# EAGLE design Robot (EAGLE 9.6.1)

## Sheet 1 of 2
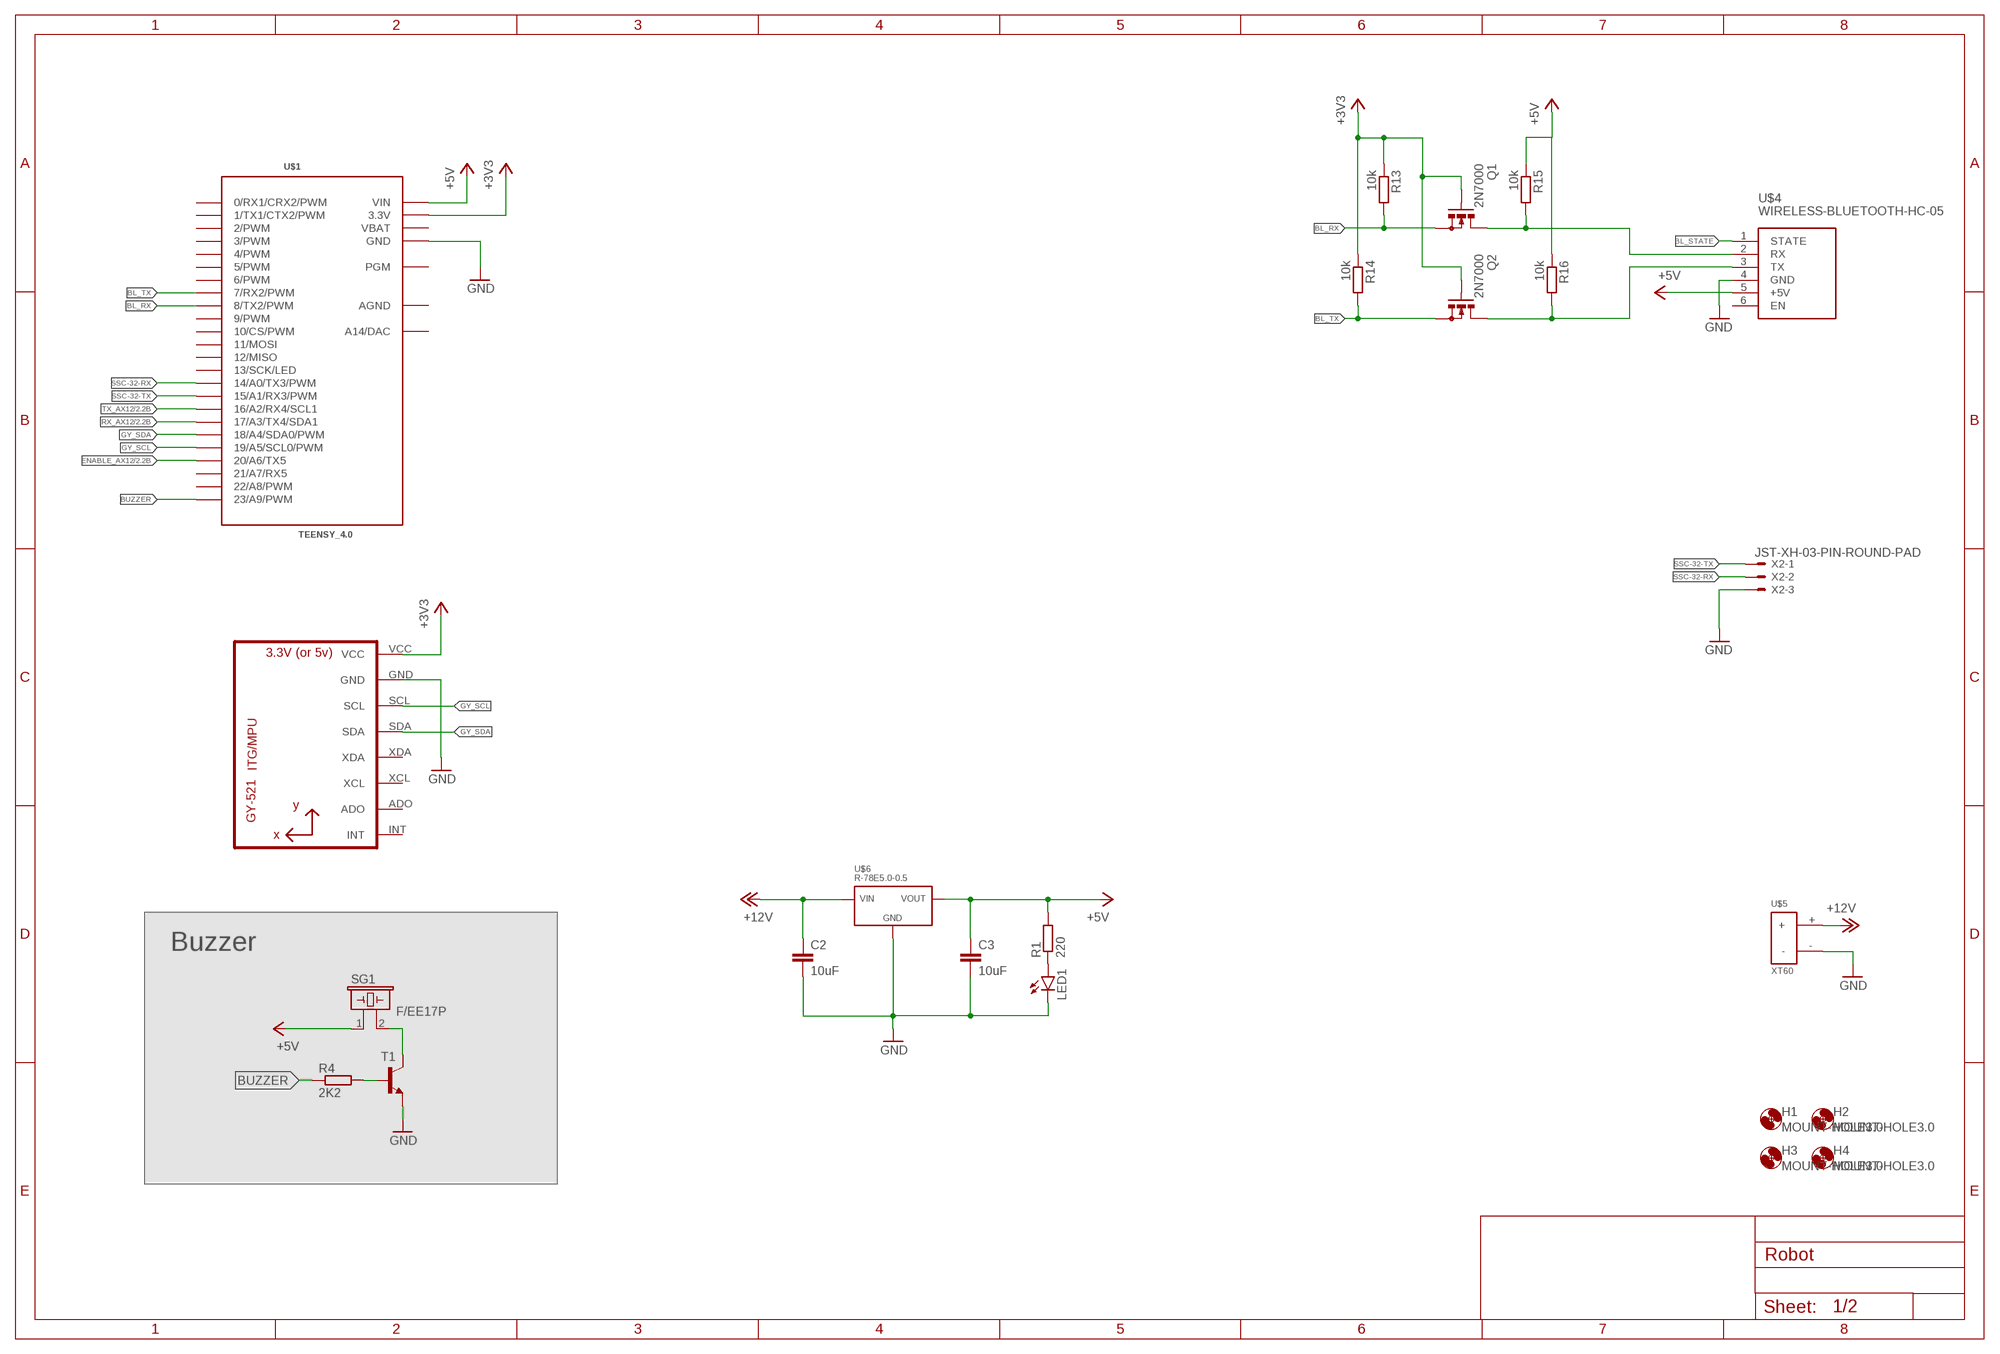
[diagram p0: schematic, sheet 1]

### Parts
C2  10uF  C-EU050-024X044  [C050-024X044]
C3  10uF  C-EU050-024X044  [C050-024X044]
H1  MOUNT-HOLE3.0  [3,0]
H2  MOUNT-HOLE3.0  [3,0]
H3  MOUNT-HOLE3.0  [3,0]
H4  MOUNT-HOLE3.0  [3,0]
LED1  LED5MM  [LED5MM]
Q1  2N7000  BS170  [SOT54E]
Q2  2N7000  BS170  [SOT54E]
R1  220  R-EU_0207/10  [0207/10]
R4  2K2  R-EU_0207/10  [0207/10]
R13  10k  R-EU_0207/10  [0207/10]
R14  10k  R-EU_0207/10  [0207/10]
R15  10k  R-EU_0207/10  [0207/10]
R16  10k  R-EU_0207/10  [0207/10]
SG1  F/EE17P  [F/EE17P]
T1  -NPN-TO92-EBC  [TO92-EBC]
U1  GY-521MPU6050  [GY-521]
U$1  TEENSY_4.0  [TEENSY_4.0]
U$4  WIRELESS-BLUETOOTH-HC-05  [WIRELESS-BLUETOOTH-HC-05]
U$5  XT60  [XT60]
U$6  R-78E5.0-0.5  [R-78E5.0-0.5]
X2  JST-XH-03-PIN-ROUND-PAD  [JST-XH-03-PACKAGE-ROUND-PAD]

### Nets
+3V3: U1.VCC U$1.3V3(3.3V) U$1.3V3_1(3.3V)
+5V: C3.1 R1.2 SG1.1 U$1.VIN U$4.5(+5V) U$6.VOUT ; also sheet 2
+12V: C2.1 U$5.+ U$6.VIN ; also sheet 2
BL_RX: Q1.S R13.2 U$1.8(8/TX2/PWM)
BL_STATE: U$4.1(STATE)
BL_TX: Q2.S R14.2 U$1.7(7/RX2/PWM)
BUZZER: R4.1 U$1.23(23/A9/PWM)
ENABLE_AX12: U$1.20(20/A6/TX5) ; also sheet 2
GND: C2.2 C3.2 LED1.K(C) T1.E U1.GND U$1.GND U$1.GND2(GND) U$4.4(GND) U$5.- U$6.GND X2.3 ; also sheet 2
GY_SCL: U1.SCL U$1.19(19/A5/SCL0/PWM)
GY_SDA: U1.SDA U$1.18(18/A4/SDA0/PWM)
N$1: Q1.G Q2.G R13.1 R14.1 ; supply symbol labelled +3V3
N$3: R15.1 R16.1 ; supply symbol labelled +5V
N$5: LED1.A R1.1
N$7: R4.2 T1.B
N$8: SG1.2 T1.C
N$100: Q1.D R15.2 U$4.2(RX)
N$1001: Q2.D R16.2 U$4.3(TX)
RX_AX12: U$1.17(17/A3/TX4/SDA1) ; also sheet 2
SSC-32-RX: U$1.14(14/A0/TX3/PWM) X2.2
SSC-32-TX: U$1.15(15/A1/RX3/PWM) X2.1
TX_AX12: U$1.16(16/A2/RX4/SCL1) ; also sheet 2
Unconnected: U1.ADO U1.INT U1.XCL U1.XDA U$1.0(0/RX1/CRX2/PWM) U$1.1(1/TX1/CTX2/PWM) U$1.2(2/PWM) U$1.3(3/PWM) U$1.4(4/PWM) U$1.5(5/PWM) U$1.6(6/PWM) U$1.9(9/PWM) U$1.10(10/CS/PWM) U$1.11(11/MOSI) U$1.12(12/MISO) U$1.13(13/SCK/LED) U$1.21(21/A7/RX5) U$1.22(22/A8/PWM) U$1.PGM U$1.RESET/DAC(A14/DAC) U$4.6(EN)

### Notes on the sheet
- Buzzer

## Sheet 2 of 2
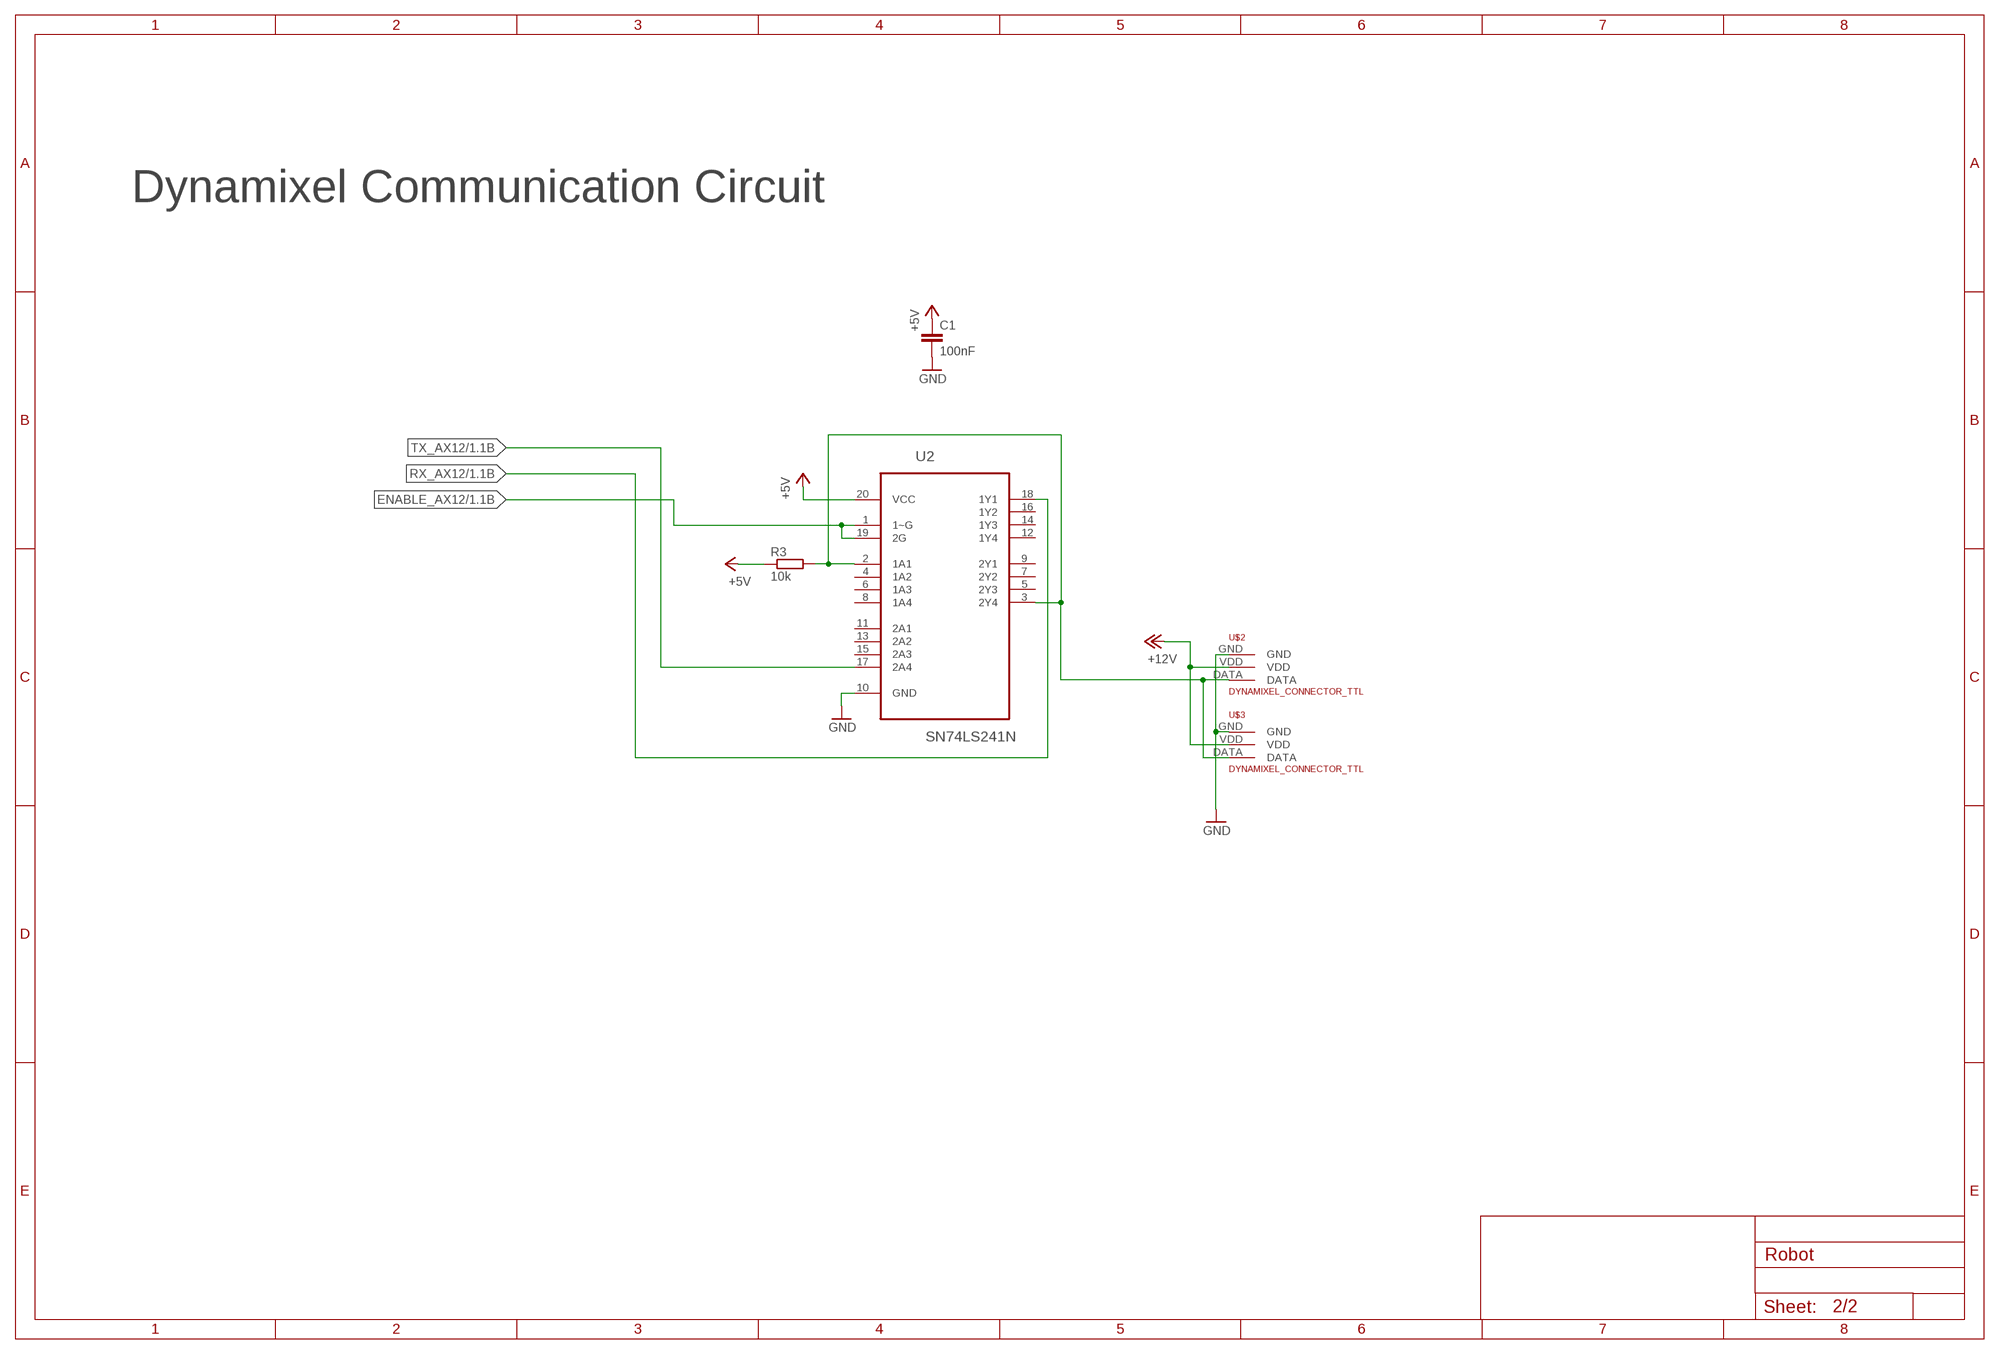
[diagram p1: schematic, sheet 2]

### Parts
C1  100nF  C-EU050-024X044  [C050-024X044]
R3  10k  R-EU_0207/10  [0207/10]
U2  SN74LS241N  [DIP254P762X508-20]
U$2  DYNAMIXEL_CONNECTOR_TTL  [DYNAMIXEL_CONNECTOR_TTL]
U$3  DYNAMIXEL_CONNECTOR_TTL  [DYNAMIXEL_CONNECTOR_TTL]

### Nets
+5V: C1.1 R3.1 U2.20(VCC) ; also sheet 1
+12V: U$2.VDD U$3.VDD ; also sheet 1
DATA: R3.2 U2.2(1A1) U2.3(2Y4) U$2.DATA U$3.DATA
ENABLE_AX12: U2.1(1~G) U2.19(2G) ; also sheet 1
GND: C1.2 U2.10(GND) U$2.GND U$3.GND ; also sheet 1
RX_AX12: U2.18(1Y1) ; also sheet 1
TX_AX12: U2.17(2A4) ; also sheet 1
Unconnected: U2.4(1A2) U2.5(2Y3) U2.6(1A3) U2.7(2Y2) U2.8(1A4) U2.9(2Y1) U2.11(2A1) U2.12(1Y4) U2.13(2A2) U2.14(1Y3) U2.15(2A3) U2.16(1Y2)

### Notes on the sheet
- Dynamixel Communication Circuit

## Power pins joined to a net without a drawn wire
AGND: U$1.AGND
VBAT: U$1.VBAT

## Library data of the parts
C1-C3 = rcl:C-EU: CAPACITOR, European symbol; SPICEPREFIX: C
H1-H4 = holes:MOUNT-HOLE: MOUNTING HOLE with drill center marker
LED1 = led:LED: LED OSRAM: - CHIPLED LG R971, LG N971, LY N971, LG Q971, LY Q971, LO R971, LY R971 LH N974, LH R974 LS Q976, LO Q976, LY Q976 LO Q996 - Hyper CHIPLED LW Q18S LB Q993, LB Q99A, LB R99A - SideLED LS A670, LO A670, LY A670, LG A670, LP A670 LB A673, LV A673, LT A673, LW A673 LH A674 LY A675 LS A676, LA A676, LO A676, LY A676, LW A676 LS A679, LY A679, LG A679 - Hyper Micro SIDELED® LS Y876, LA Y876, LO Y876, LY Y876 LT Y87S - SmartLED LW L88C, LW L88S LB L89C, LB L89S, LG L890 LS L89K, LO L89K, LY L89K LS L896, LA L896, LO L896, LY L896 - TOPLED LS T670, LO T670, LY T670, LG T670, LP T670 LSG T670, LSP T670, LSY T670, LOP T670, LYG T670 LG T671, LOG T671, LSG T671 LB T673, LV T673, LT T673, LW T673 LH T674 LS T676, LA T676, LO T676, LY T676, LB T676, LH T676, LSB T676, LW T676 LB T67C, LV T67C, LT T67C, LS T67K, LO T67K, LY T67K, LW E67C LS E67B, LA E67B, LO E67B, LY E67B, LB E67C, LV E67C, LT E67C LW T67C LS T679, LY T679, LG T679 LS T770, LO T770, LY T770, LG T770, LP T770 LB T773, LV T773, LT T773, LW T773 LH T774 LS E675, LA E675, LY E675, LS T675 LS T776, LA T776, LO T776, LY T776, LB T776 LHGB T686 LT T68C, LB T68C - Hyper Mini TOPLED® LB M676 - Mini TOPLED Santana® LG M470 LS M47K, LO M47K, LY M47K Source: http://www.osram.convergy.de LUXEON: - LUMILED® LXK2-PW12-R00, LXK2-PW12-S00, LXK2-PW14-U00, LXK2-PW14-V00 LXK2-PM12-R00, LXK2-PM12-S00, LXK2-PM14-U00 LXK2-PE12-Q00, LXK2-PE12-R00, LXK2-PE12-S00, LXK2-PE14-T00, LXK2-PE14-U00 LXK2-PB12-K00, LXK2-PB12-L00, LXK2-PB12-M00, LXK2-PB14-N00, LXK2-PB14-P00, LXK2-PB14-Q00 LXK2-PR12-L00, LXK2-PR12-M00, LXK2-PR14-Q00, LXK2-PR14-R00 LXK2-PD12-Q00, LXK2-PD12-R00, LXK2-PD12-S00 LXK2-PH12-R00, LXK2-PH12-S00 LXK2-PL12-P00, LXK2-PL12-Q00, LXK2-PL12-R00 Source: www.luxeon.com KINGBRIGHT: KA-3528ASYC Source: www.kingbright.com
Q1 Q2 = transistor-small-signal:BS170: N-CHANNEL MOS FET
R1 R3 R4 R13-R16 = rcl:R-EU_: RESISTOR, European symbol; SPICEPREFIX: R
SG1 = buzzer:F/EE17P: BUZZER Source: Buerklin; OC_FARNELL: unknown; OC_NEWARK: unknown
T1 = transistor:*-NPN-: NPN Transistror BF959 corrected 2008.03.06
U1 = gy-521:GY-521
U2 = SN74LS241N:SN74LS241N: OCTAL BUFFERS AND LINE DRIVERS WITH 3-STATE OUTPUTS; AVAILABILITY: Unavailable; MF: Texas Instruments; MP: SN74LS241N; PACKAGE: PDIP-20 Motorola; PRICE: None
U$1 = Teensy_3_and_LC_Series_Boards_v1.4:TEENSY_4.0
U$2 U$3 = DYNAMIXEL_CONNECTOR_TTL:DYNAMIXEL_CONNECTOR_TTL
U$4 = TP4056:WIRELESS-BLUETOOTH-HC-05: Bluetooth Transceiver Module based on HC-05 board Tutorial is available here: https://arduino-info.wikispaces.com/BlueTooth-HC05-HC06-Modules-How-To Click here to find device on ebay.com <http://www.ebay.com/sch/hc-05+module+rs232>
U$5 = XT60:XT60
U$6 = Power:R-78E5.0-0.5
X2 = JST XH Connectors v1-0:JST-XH-03-PIN: JST XH Connector 2 Pin Wire to board connector. Pitch: 2,54 mm, (0.100") Number of pins: 3 Created by Rembrandt Electronics www.rembrandtelectronics.com

## Board
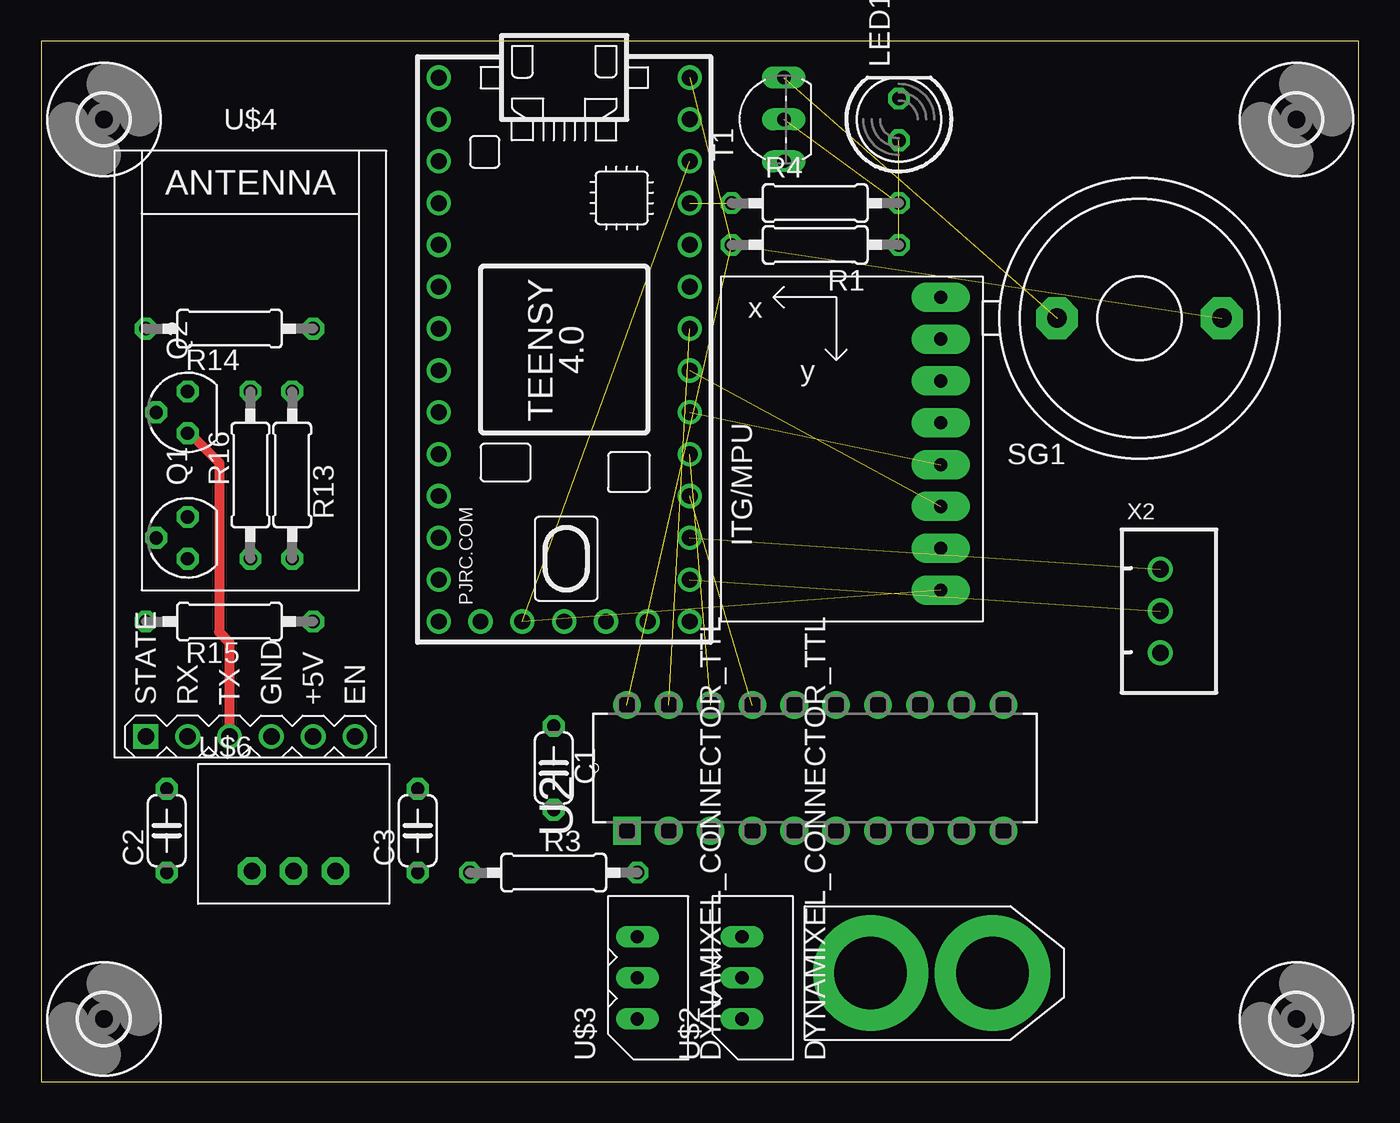
[diagram p2: board, top side]
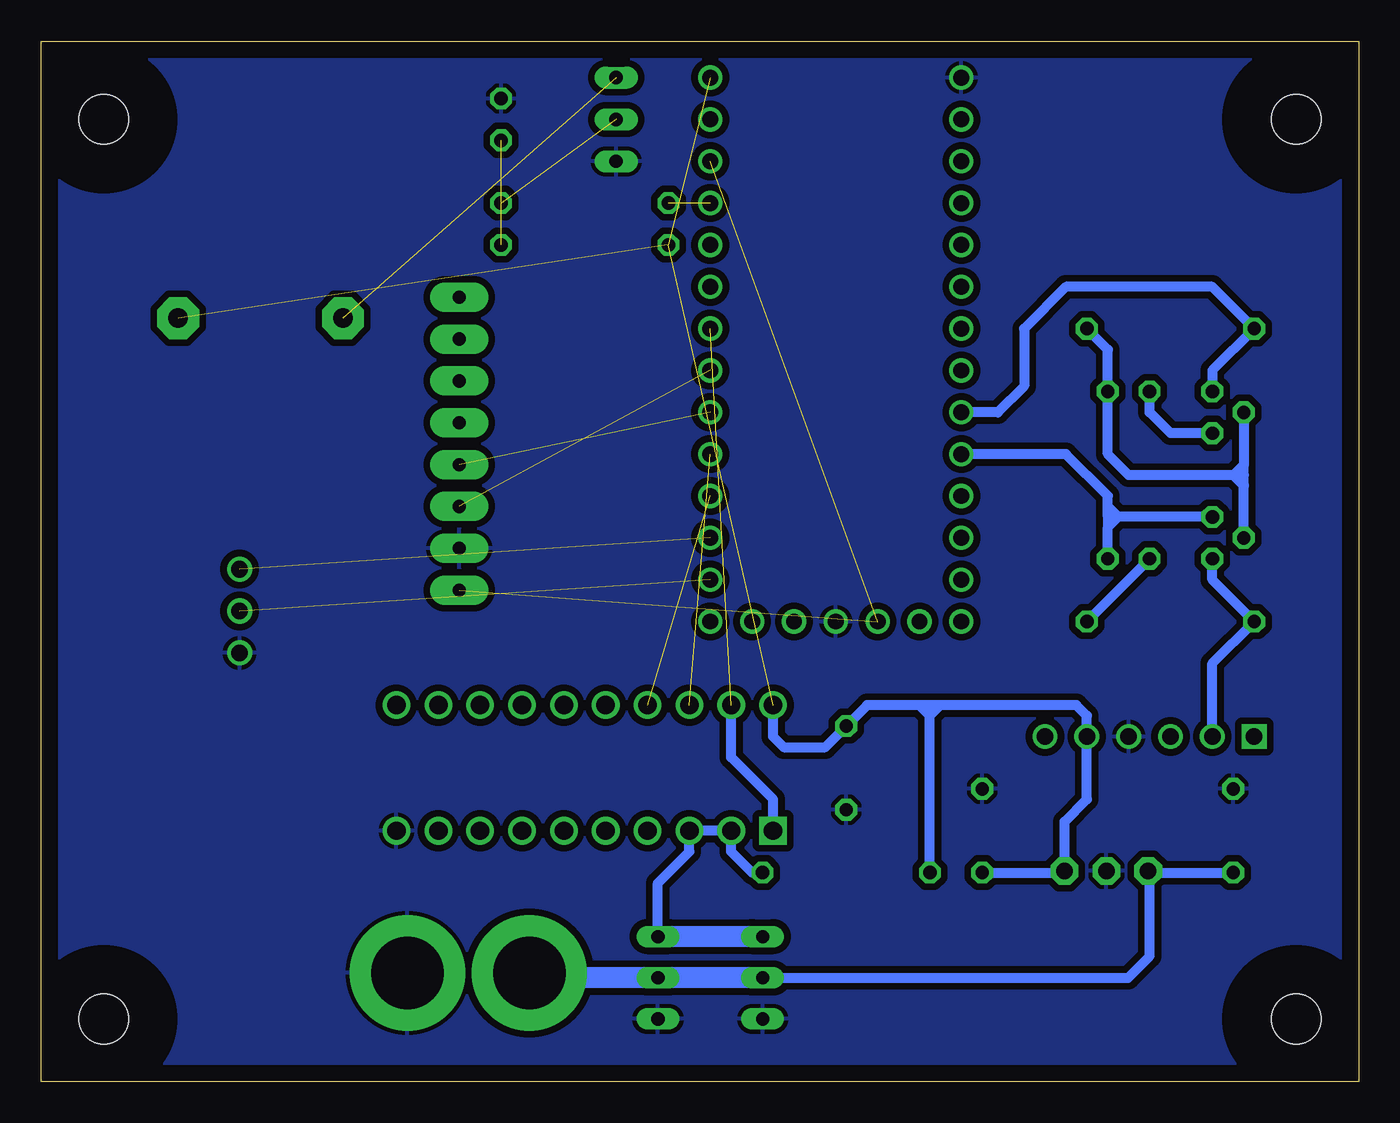
[diagram p3: board, bottom side, seen from below]

Size 79.99 x 63.17 mm. Coordinates in mm from the lower left corner, seen from the top.
Outline: 0,0 79.99,0 79.99,63.17 0,63.17 0,0
Copper layers (1*16): Top 0.035mm / dielectric 1.5mm / Bottom 0.035mm
Design rules "default": minimum track width 6mil, minimum drill 0.35mm, track to track 6mil, track to pad 6mil, pad to pad 6mil, via to via 6mil, smd to smd 6mil, copper to edge 40mil, drill to drill 6mil, minimum pad ring 10mil, minimum via ring 8mil, stop-mask expansion 4mil, vias tented up to drill 0mil, thermal gap 10mil

### Footprints (pad centres in the part's own frame; a part is rotated, then mirrored left to right if it is on the bottom)
C050-024X044 = drill 0.813 octagon: 1 -2.54,0; 2 2.54,0
3,0 = hole 3: 0,0
LED5MM = drill 0.813 octagon: A -1.27,0; K 1.27,0
SOT54E = drill 0.813 octagon: D -1.27,0; G 0,1.905; S 1.27,0
0207/10 = drill 0.813 octagon: 1 -5.08,0; 2 5.08,0
F/EE17P = drill 1.194 pad 2.54 octagon: 1 -5.004,0; 2 5.004,0
TO92-EBC = drill 0.813 long: B 0,-1.27; C 2.54,-1.27; E -2.54,-1.27
GY-521 = drill 0.8 pad 1.778 long: ADO -8.89,-6.35; GND -8.89,6.35; INT -8.89,-8.89; SCL -8.89,3.81; SDA -8.89,1.27; VCC -8.89,8.89; XCL -8.89,-3.81; XDA -8.89,-1.27
DIP254P762X508-20 = drill 1.118 square: 1 -7.62,22.86 | drill 1.118: 2 -7.62,20.32; 3 -7.62,17.78; 4 -7.62,15.24; 5 -7.62,12.7; 6 -7.62,10.16; 7 -7.62,7.62; 8 -7.62,5.08; 9 -7.62,2.54; 10 -7.62,0; 11 0,0; 12 0,2.54; 13 0,5.08; 14 0,7.62; 15 0,10.16; 16 0,12.7; 17 0,15.24; 18 0,17.78; 19 0,20.32; 20 0,22.86
TEENSY_4.0 = drill 0.965: 0 -13.97,-7.62; 1 -11.43,-7.62; 2 -8.89,-7.62; 3 -6.35,-7.62; 3V3 -11.43,7.62; 3V3_1 16.51,-2.54; 4 -3.81,-7.62; 5 -1.27,-7.62; 6 1.27,-7.62; 7 3.81,-7.62; 8 6.35,-7.62; 9 8.89,-7.62; 10 11.43,-7.62; 11 13.97,-7.62; 12 16.51,-7.62; 13 16.51,7.62; 14 13.97,7.62; 15 11.43,7.62; 16 8.89,7.62; 17 6.35,7.62; 18 3.81,7.62; 19 1.27,7.62; 20 -1.27,7.62; 21 -3.81,7.62; 22 -6.35,7.62; 23 -8.89,7.62; AGND -13.97,7.62; GND -16.51,-7.62; GND2 16.51,0; PGM 16.51,2.54; RESET/DAC 16.51,5.08; VBAT 16.51,-5.08; VIN -16.51,7.62
DYNAMIXEL_CONNECTOR_TTL = drill 0.8 long: DATA 5,0; GND 0,0; VDD 2.5,0
WIRELESS-BLUETOOTH-HC-05 = drill 1 square: 1 -6.35,-17.145 | drill 1: 2 -3.81,-17.145; 3 -1.27,-17.145; 4 1.27,-17.145; 5 3.81,-17.145; 6 6.35,-17.145
XT60 = drill 4.4 pad 7: + 4,4.064; - 11.4,4.064
R-78E5.0-0.5 = drill 1 pad 1.676 octagon: GND 5.8,2; VIN 3.26,2; VOUT 8.34,2
JST-XH-03-PACKAGE-ROUND-PAD = drill 1.016: 1 -2.54,0; 2 0,0; 3 2.54,0

### Placement (x,y rotation side)
C1  31.11,19.05 270 top
C2  7.62,15.24 90 top
C3  22.86,15.24 90 top
H1  3.81,3.81 0 top
H2  76.2,3.81 0 top
H3  3.81,58.42 0 top
H4  76.2,58.42 0 top
LED1  52.07,58.42 90 top
Q1  8.89,33.02 90 top
Q2  8.89,40.64 90 top
R1  46.99,50.8 180 top
R3  31.11,12.7 0 top
R4  46.99,53.34 0 top
R13  15.24,36.83 270 top
R14  11.43,45.72 180 top
R15  11.43,27.94 180 top
R16  12.7,36.83 90 top
SG1  66.67,46.35 180 top
T1  43.81,58.42 90 top
U1  45.72,38.73 180 top
U2  58.42,22.86 90 top
U$1  31.75,44.45 270 top
U$2  42.55,3.81 90 top
U$3  36.2,3.81 90 top
U$4  12.7,38.1 0 top
U$5  46.35,2.54 0 top
U$6  9.53,10.79 0 top
X2  67.94,28.57 270 top

### Tracks (layer width: path | path; a pad name or v marks a point on that pad's centre or on a via)
+3V3  (2 unrouted)
+5V  (3 unrouted)
  Bottom 0.61: U2.20 35.56,20.95 34.92,20.32 32.38,20.32 C1.1 29.84,22.86 26.67,22.86 | C3.1 17.96,12.7 U$6.VOUT 17.86,15.79 16.51,17.14 U$4.5 16.51,22.23 17.14,22.86 25.4,22.86 | 25.4,22.86 26.04,22.86 | 26.04,22.86 26.67,22.86 | R3.1 26.04,22.23 | 26.04,22.23 26.04,22.86 | 26.67,22.86 26.04,22.23 | 26.04,22.23 25.4,22.86
+12V
  Bottom 0.61: C2.1 12.69,12.7 U$6.VIN 12.7,12.71 12.7,7.62 14.01,6.31 U$3.VDD
  Bottom 1.27: U$3.VDD U$2.VDD 50.06,6.31 U$5.+
BL_RX
  Bottom 0.61: R13.2 15.24,33.66 | 15.24,34.29 15.24,33.66 | 15.24,34.29 15.24,34.92 | 15.24,34.92 15.24,35.56 17.78,38.1 U$1.8 | Q1.S 14.61,34.29 | 14.61,34.29 15.24,34.29 | 15.24,33.66 14.61,34.29 | 14.61,34.29 15.24,34.92
BL_TX
  Bottom 0.61: Q2.S 8.89,43.18 R14.2 8.89,48.26 17.78,48.26 20.32,45.72 20.32,42.23 21.91,40.64 U$1.7
BUZZER  (1 unrouted)
DATA
  Bottom 0.61: R3.2 36.83,12.7 38.1,13.97 U2.2 U2.3 40.64,13.97 42.55,12.06 U$2.DATA
  Bottom 1.27: U$3.DATA U$2.DATA
ENABLE_AX12  (1 unrouted)
  Bottom 0.61: U2.1 35.56,17.14 38.1,19.68 U2.19
GND
  pour Bottom (isolate 0.406): 0,0 80.01,0 80.01,63.5 0,63.5
GY_SCL  (1 unrouted)
GY_SDA  (1 unrouted)
N$1
  Bottom 0.61: Q1.G 6.99,36.2 | 6.99,36.2 6.99,36.83 | 6.99,36.83 6.99,37.47 | Q2.G 6.99,37.47 | R14.1 15.24,44.45 R13.1 15.24,38.1 13.97,36.83 7.62,36.83 | 6.99,36.83 7.62,36.83 | 6.99,37.47 7.62,36.83 | 6.99,36.2 7.62,36.83
N$3
  Bottom 0.61: R16.1 R15.1
N$5  (1 unrouted)
N$7  (1 unrouted)
N$8  (1 unrouted)
N$100
  Bottom 0.61: Q1.D 8.89,30.48 R15.2 8.89,25.4 U$4.2
N$1001
  Top 0.61: Q2.D 9.02,39.37 10.79,37.59 10.79,27.3 11.43,26.67 U$4.3
  Bottom 0.61: Q2.D 11.43,39.37 12.7,40.64 R16.2
RX_AX12  (1 unrouted)
SSC-32-RX  (1 unrouted)
SSC-32-TX  (1 unrouted)
TX_AX12  (1 unrouted)